# Altium schematic sheet Battery.SchDoc: TITLE
size A4; DrawnBy: D Kleiss; Organization: Flinders University; Address1: College of Science & Engineering; Address2: Engineering Services Room 3.22; Address3: 1284 South Rd; Address4: SA 5042; DocumentNumber: A4; Revision: 1; SheetNumber: 1; SheetTotal: 1
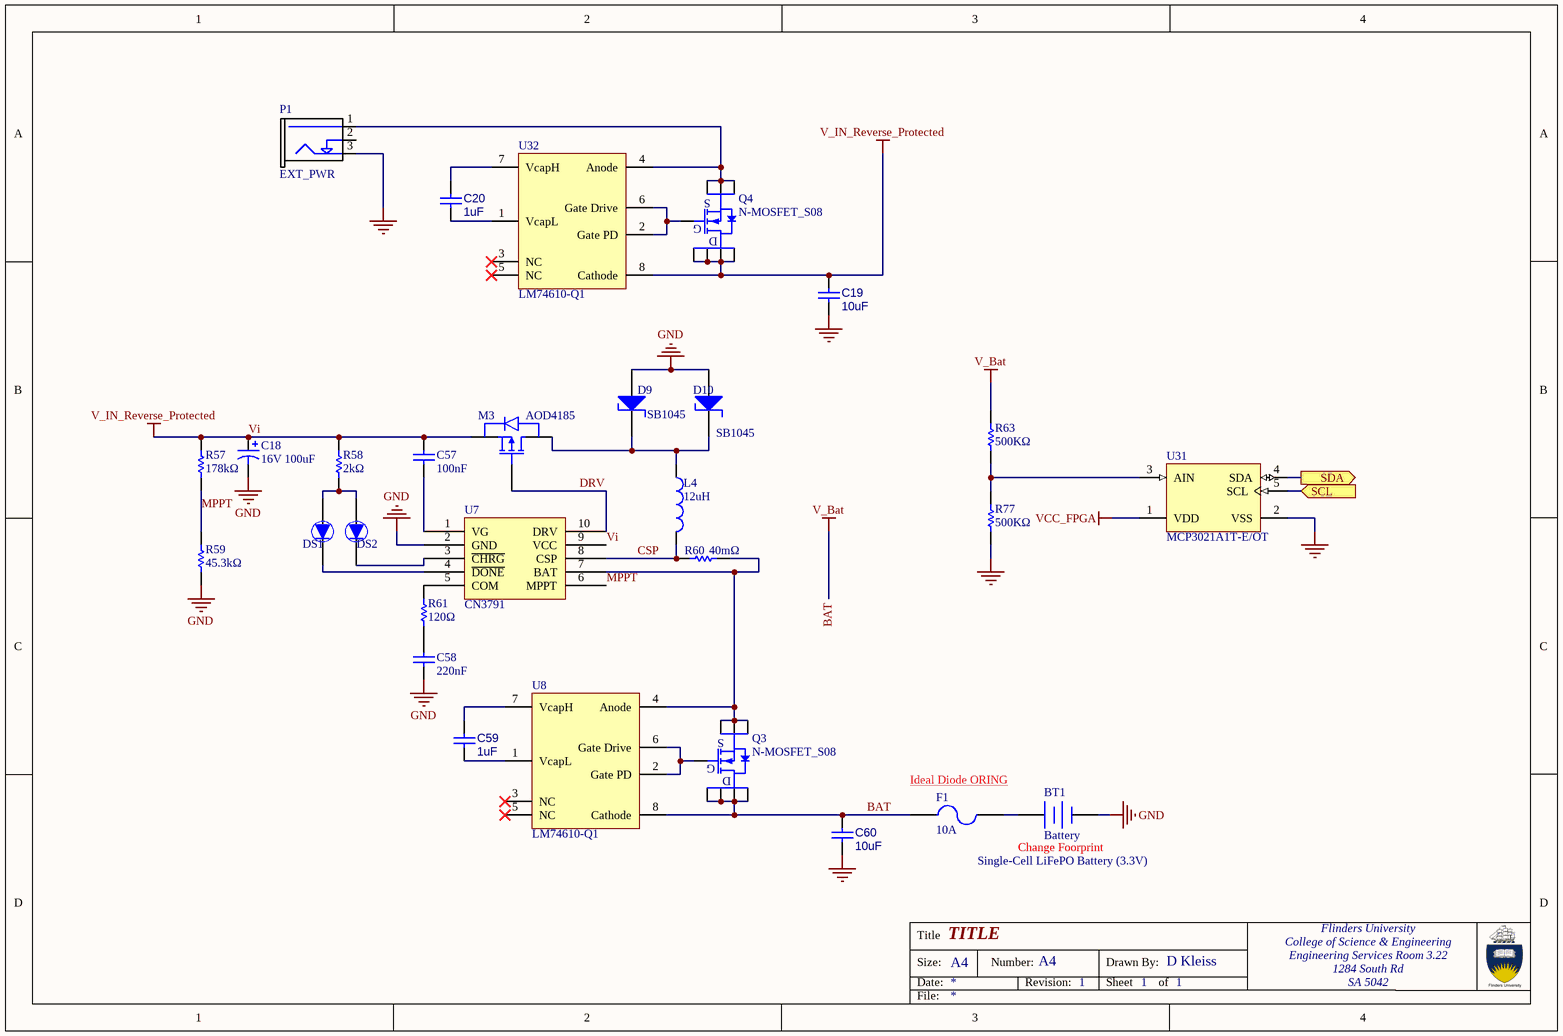
[diagram p0: Battery.SchDoc]

## Parts
BT1  Battery  [CONNECTOR PHOENIX 1757242]
C18  16V 100uF  [KEMT-T491-D_L]
C19  10uF  [0603_CAP UF HD]
C20  1uF  [0603_CAP UF HD]
C57  100nF  [0603_CAP UF HD]
C58  220nF  [0603_CAP UF HD]
C59  1uF  [0603_CAP UF HD]
C60  10uF  [0603_CAP UF HD]
D9  SB1045  [FP-95570-MFG]
D10  SB1045  [FP-95570-MFG]
DS1  LED  [3.2X1.6X1.1]  (value not drawn)
DS2  LED  [3.2X1.6X1.1]  (value not drawn)
F1  10A  [FUSE OMF125]
L4  12uH  [WE-PD-L]
M3  AOD4185  [FP-C04-189-MFG]
P1  EXT_PWR  [DCPOWER - P0620]
Q3  N-MOSFET_S08  [SOIC-8-H_SLDR]
Q4  N-MOSFET_S08  [SOIC-8-H_SLDR]
R57  178kΩ  [1608[0603]]
R58  2kΩ  [1608[0603]]
R59  45.3kΩ  [1608[0603]]
R60  40mΩ  [0603-RESISTOR HD]
R61  120Ω  [1608[0603]]
R63  500KΩ  [0603-RESISTOR HD]
R77  500KΩ  [0603-RESISTOR HD]
U7  CN3791  [SSOP10]
U8  LM74610-Q1  [TI-DGK8_V]
U31  MCP3021A1T-E/OT  [SOT-23-OT5_M]
U32  LM74610-Q1  [TI-DGK8_V]

## Ports
SCL (in), SDA (out)

## Nets
GND: BT1.2(-) C18.2 C19.2 C58.1 C60.2 D9.1(A) D10.1(A) P1.3 R59.1 R77.2 U7.2(GND) U31.2(VSS)
V_Bat: R63.1
VCC_FPGA: U31.1(VDD)
Vi: C18.1 C19.1 C57.2 M3.3(S) Q4.5(D) Q4.6(D) Q4.7(D) Q4.8(D) R57.2 R58.2 U7.9(VCC) U32.8(Cathode)  [also labelled V_IN_Reverse_Protected]
BAT: C60.1 F1.2 Q3.5(D) Q3.6(D) Q3.7(D) Q3.8(D) U8.8(Cathode)
CSP: L4.2 R60.2 U7.8(CSP)
DRV: M3.1(G) U7.10(DRV)
MPPT: R57.1 R59.2 U7.6(MPPT)
SCL: U31.5(SCL) ; port SCL
SDA: U31.4(SDA) ; port SDA
NetBT1_1: BT1.1(+) F1.1
NetC20_1: C20.1 U32.7(VcapH)
NetC20_2: C20.2 U32.1(VcapL)
NetC57_1: C57.1 U7.1(VG)
NetC58_2: C58.2 R61.1
NetC59_1: C59.1 U8.7(VcapH)
NetC59_2: C59.2 U8.1(VcapL)
NetD9_2: D9.2(K) D10.2(K) L4.1 M3.2(D)
NetDS1_1: DS1.1(A) DS2.1(A) R58.1
NetDS1_2: DS1.2(K) U7.4(~{DONE})
NetDS2_2: DS2.2(K) U7.3(~{CHRG})
NetP1_1: P1.1 Q4.1(S) Q4.2(S) Q4.3(S) U32.4(Anode)
NetQ3_1: Q3.1(S) Q3.2(S) Q3.3(S) R60.1 U7.7(BAT) U8.4(Anode)
NetQ3_4: Q3.4(G) U8.2(Gate_PD) U8.6(Gate_Drive)
NetQ4_4: Q4.4(G) U32.2(Gate_PD) U32.6(Gate_Drive)
NetR61_2: R61.2 U7.5(COM)
NetR63_2: R63.2 R77.1 U31.3(AIN)

Not connected (* = marked no-connect by the designer): P1 2; U8 3(NC)* 5(NC)*; U32 3(NC)* 5(NC)*

## Notes on the sheet
- Ideal Diode ORING
- (near BT1) Change Foorprint
- Single-Cell LiFePO Battery (3.3V)
- Labels drawn without touching a wire or pin: BAT
- Title
- Size:
- Date:
- A4
- Number:
- Revision:
- Sheet
- Drawn By:
- of
- File:

## Library data of the parts
BT1 = Battery: Multicell Battery; Manufacturer: Phoenix; Manufacturer Number: 1757242; Digikey Number: 277-1106-ND
C18 = cap: 有極性電容
C19 C60 = Cap: Capacitor; Manufacturer: Murata; Manufacturer Number: GRM188D71A106MA73D; Value: 10uF; Digikey Number: 490-7200-1-ND
C20 C59 = Cap: Capacitor; Manufacturer: Samsung; Manufacturer Number: CL10B105MO8NNWC; Value: 1uF; Digikey Number: 1276-6524-1-ND
C57 C58 = cap2
D9 D10 = SB1045: 10.0A SCHOTTKY BARRIER RECTIFIER
F1 = Fuse: Manufacturer: Schurter Inc.; Manufacturer Number: 3404.0021.11; Digikey Number: 486-2999-ND; Value: 10A
L4 = inductor_1
M3 = AOD4185: P-Channel Enhancement Mode Field Effect Transistor; pin to pad: 2>4
P1 = DCPOWER: 2.1mm DC JACK; Manufacturer: Wurth Electronics Inc.; Manufacturer Number: 694106301002; Digikey Number: 732-5930-ND
Q3 Q4 = N-MOSFET_S08: N-Mosfet SOIC-8; Digikey Number: RS1G120MNTBCT-ND
R57-R59 R61 = Res: Resistor; Published: 8-Jun-2000; LatestRevisionDate: 17-Jul-2002; LatestRevisionNote: Re-released for DXP Platform.; PackageReference: AXIAL-0.3; Publisher: Altium Limited
R60 R63 R77 = Res: R sense
U7 = CN3791: 4A, Standalone Li-ion Battery Charger IC  With Photovoltaic Cell MPPT Function
U8 U32 = LM74610-Q1: Zero IQ Reverse Polarity Protection Smart Diode Controller
U31 = CMP-0188-01201-1: Low Power 10-Bit A/D Converter With I2C Interface, 5-Pin SOT-23, Extended Temperature, Tape and Reel; ComponentLink2URL: http://ww1.microchip.com/downloads/en/DeviceDoc/21805a.pdf; PackageDescription: 5-Lead Plastic Small Outline Transistor (OT) [SOT-23]; PackageVersion: revBB, Aug-2009; DatasheetVersion: revA, May-2003; ComponentLink2Description: Datasheet; ComponentLink1Description: Manufacturer URL; PackageReference: SOT-23-OT5; ComponentLink3Description: Package Specification; Code_IPC: SOT23-5; ComponentLink3URL: http://www.microchip.com/stellent/groups/techpub_sg/documents/packagingspec/en012702.pdf; ComponentLink1URL: http://www.microchip.com/